# EAGLE design Ad8232_placa_V5 (EAGLE 9.6.2)
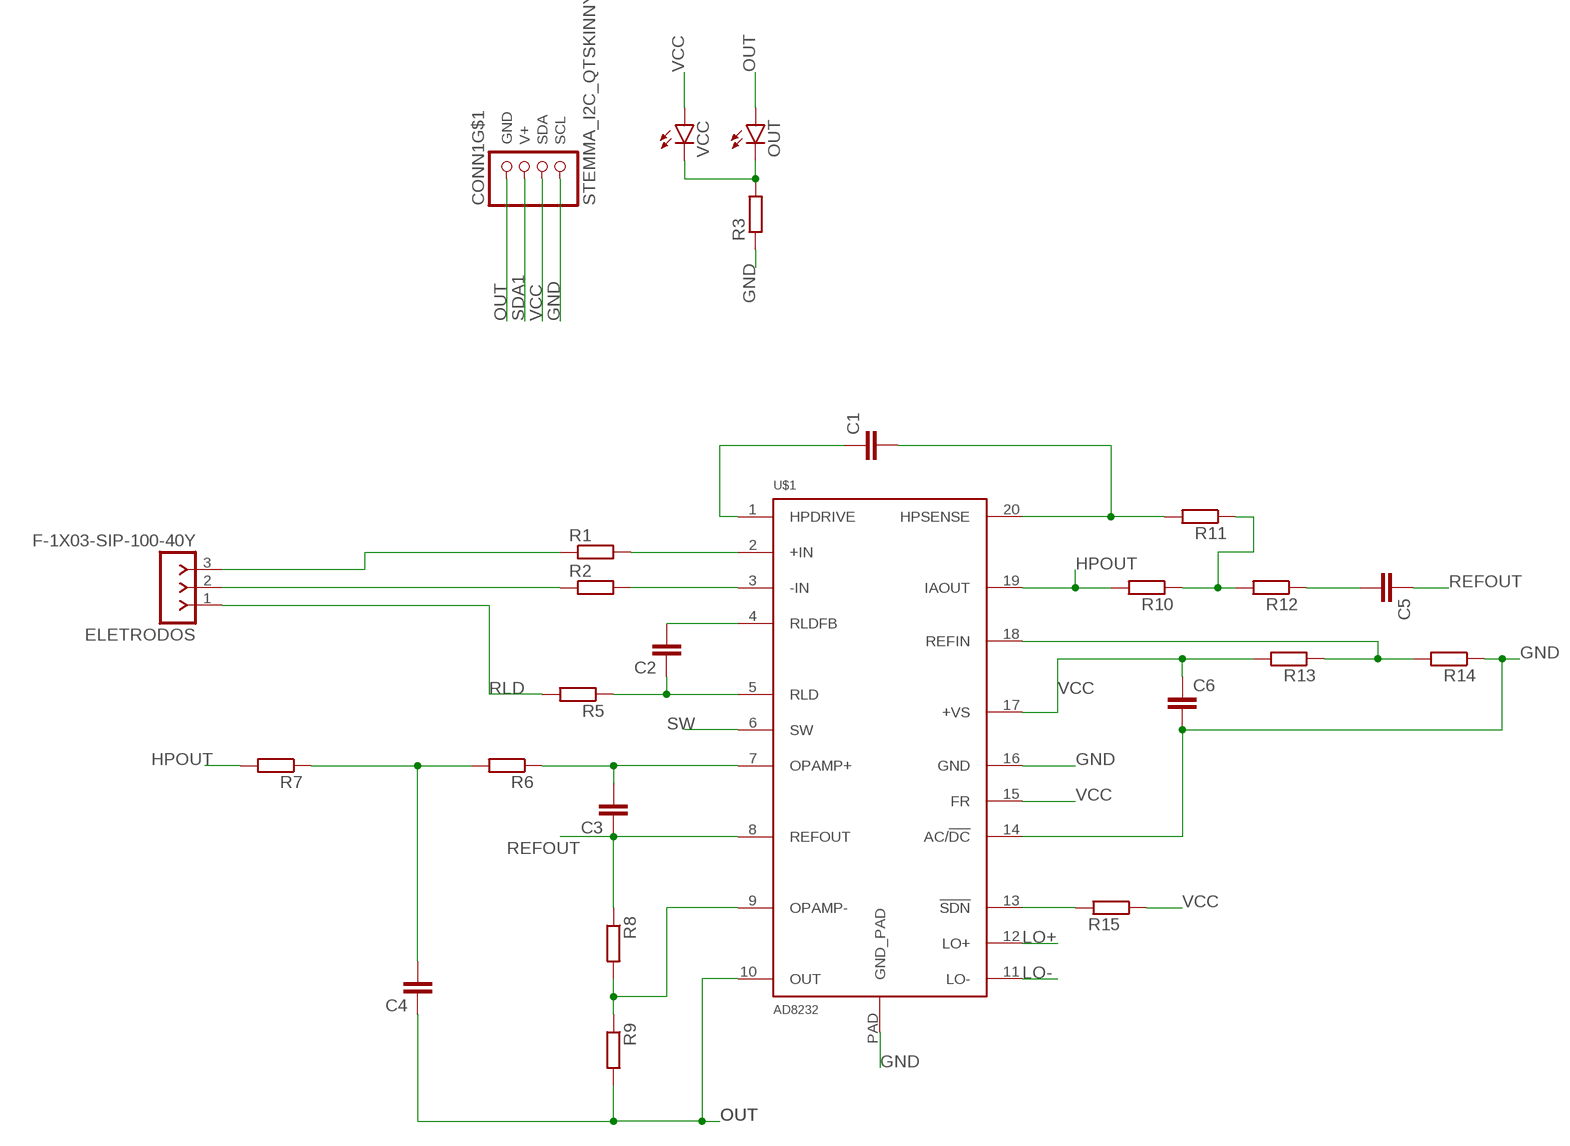
[diagram p0: schematic, sheet 1]

## Parts
C1  C-EUC0402K  [C0402K]
C2  C-EUC0402K  [C0402K]
C3  C-EUC0402K  [C0402K]
C4  C-EUC0402K  [C0402K]
C5  C-EUC0402K  [C0402K]
C6  C-EUC0402K  [C0402K]
CONN1  STEMMA_I2C_QTSKINNY  [JST_SH4_SKINNY]
ELETRODOS  F-1X03-SIP-100-40Y  [SIP-100-03-40Y]
OUT  LEDCHIPLED_0603  [CHIPLED_0603]
R1  R-EU_R0402  [R0402]
R2  R-EU_R0402  [R0402]
R3  R-EU_R0402  [R0402]
R5  R-EU_R0402  [R0402]
R6  R-EU_R0402  [R0402]
R7  R-EU_R0402  [R0402]
R8  R-EU_R0402  [R0402]
R9  R-EU_R0402  [R0402]
R10  R-EU_R0402  [R0402]
R11  R-EU_R0402  [R0402]
R12  R-EU_R0402  [R0402]
R13  R-EU_R0402  [R0402]
R14  R-EU_R0402  [R0402]
R15  R-EU_R0402  [R0402]
U$1  AD8232  [LFCSP_20]
VCC  LEDCHIPLED_0603  [CHIPLED_0603]

## Nets
GND: C6.2 CONN1.4(SCL) R3.1 R14.1 U$1.14(AC/!DC) U$1.16(GND) U$1.PAD(GND_PAD)
HPOUT: R7.2 R10.2 U$1.19(IAOUT)
LO+: U$1.12(LO+)
LO-: U$1.11(LO-)
N$1: C1.1 U$1.1(HPDRIVE)
N$2: C1.2 R11.2 U$1.20(HPSENSE)
N$3: R1.2 U$1.2(+IN)
N$4: R2.2 U$1.3(-IN)
N$5: ELETRODOS.3 R1.1
N$6: ELETRODOS.2 R2.1
N$7: C2.2 U$1.4(RLDFB)
N$8: C2.1 R5.1 U$1.5(RLD)
N$9: C3.2 R6.1 U$1.7(OPAMP+)
N$10: R13.1 R14.2 U$1.18(REFIN)
N$11: R8.2 R9.1 U$1.9(OPAMP-)
N$12: OUT.C R3.2 VCC.C
N$13: R10.1 R11.1 R12.2
N$14: C4.2 R6.2 R7.1
N$16: R15.2 U$1.13(!SDN)
OUT: C4.1 CONN1.1(GND) OUT.A R9.2 U$1.10(OUT)
REFOUT: C3.1 C5.1 R8.1 U$1.8(REFOUT)
RLD: ELETRODOS.1 R5.2
SDA1: CONN1.2(V+)
SW: C5.2 R12.1 U$1.6(SW)
VCC: C6.1 CONN1.3(SDA) R13.2 R15.1 U$1.15(FR) U$1.17(+VS) VCC.A
Unconnected: CONN1.MT1(MT) CONN1.MT2(MT)

## Library data of the parts
C1-C6 = rcl:C-EU: CAPACITOR, European symbol; SPICEPREFIX: C
CONN1 = microbuilder:STEMMA_I2C
ELETRODOS = con-headers-jp:F-1X03-: FEMALE HEADER
OUT VCC = led:LED: LED OSRAM: - CHIPLED LG R971, LG N971, LY N971, LG Q971, LY Q971, LO R971, LY R971 LH N974, LH R974 LS Q976, LO Q976, LY Q976 LO Q996 - Hyper CHIPLED LW Q18S LB Q993, LB Q99A, LB R99A - SideLED LS A670, LO A670, LY A670, LG A670, LP A670 LB A673, LV A673, LT A673, LW A673 LH A674 LY A675 LS A676, LA A676, LO A676, LY A676, LW A676 LS A679, LY A679, LG A679 - Hyper Micro SIDELED® LS Y876, LA Y876, LO Y876, LY Y876 LT Y87S - SmartLED LW L88C, LW L88S LB L89C, LB L89S, LG L890 LS L89K, LO L89K, LY L89K LS L896, LA L896, LO L896, LY L896 - TOPLED LS T670, LO T670, LY T670, LG T670, LP T670 LSG T670, LSP T670, LSY T670, LOP T670, LYG T670 LG T671, LOG T671, LSG T671 LB T673, LV T673, LT T673, LW T673 LH T674 LS T676, LA T676, LO T676, LY T676, LB T676, LH T676, LSB T676, LW T676 LB T67C, LV T67C, LT T67C, LS T67K, LO T67K, LY T67K, LW E67C LS E67B, LA E67B, LO E67B, LY E67B, LB E67C, LV E67C, LT E67C LW T67C LS T679, LY T679, LG T679 LS T770, LO T770, LY T770, LG T770, LP T770 LB T773, LV T773, LT T773, LW T773 LH T774 LS E675, LA E675, LY E675, LS T675 LS T776, LA T776, LO T776, LY T776, LB T776 LHGB T686 LT T68C, LB T68C - Hyper Mini TOPLED® LB M676 - Mini TOPLED Santana® LG M470 LS M47K, LO M47K, LY M47K Source: http://www.osram.convergy.de LUXEON: - LUMILED® LXK2-PW12-R00, LXK2-PW12-S00, LXK2-PW14-U00, LXK2-PW14-V00 LXK2-PM12-R00, LXK2-PM12-S00, LXK2-PM14-U00 LXK2-PE12-Q00, LXK2-PE12-R00, LXK2-PE12-S00, LXK2-PE14-T00, LXK2-PE14-U00 LXK2-PB12-K00, LXK2-PB12-L00, LXK2-PB12-M00, LXK2-PB14-N00, LXK2-PB14-P00, LXK2-PB14-Q00 LXK2-PR12-L00, LXK2-PR12-M00, LXK2-PR14-Q00, LXK2-PR14-R00 LXK2-PD12-Q00, LXK2-PD12-R00, LXK2-PD12-S00 LXK2-PH12-R00, LXK2-PH12-S00 LXK2-PL12-P00, LXK2-PL12-Q00, LXK2-PL12-R00 Source: www.luxeon.com KINGBRIGHT: KA-3528ASYC Source: www.kingbright.com
R1-R3 R5-R15 = rcl:R-EU_: RESISTOR, European symbol; SPICEPREFIX: R
U$1 = AD8232:AD8232: Check prices <https://pricing.snapeda.com/parts/AD8232/Analog%20Devices/view-part?ref=eda>; AVAILABILITY: Not in stock; DESCRIPTION: AD8232 Sensor Signal Conditioner Interface Evaluation Board; MF: Analog Devices; MP: AD8232; PACKAGE: LFCSP-20 Analog Devices; PRICE: None

## Net classes
1 power: width 0.254 mm

## Board
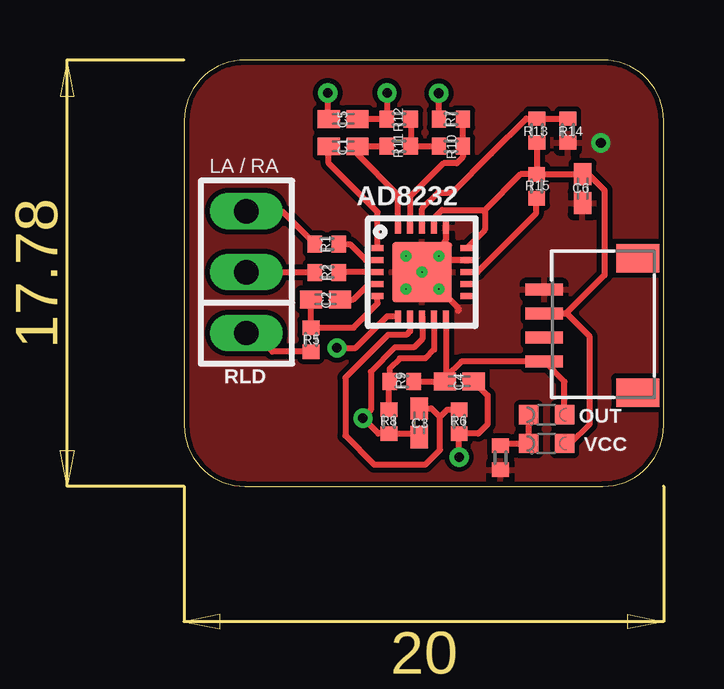
[diagram p1: board, top side]
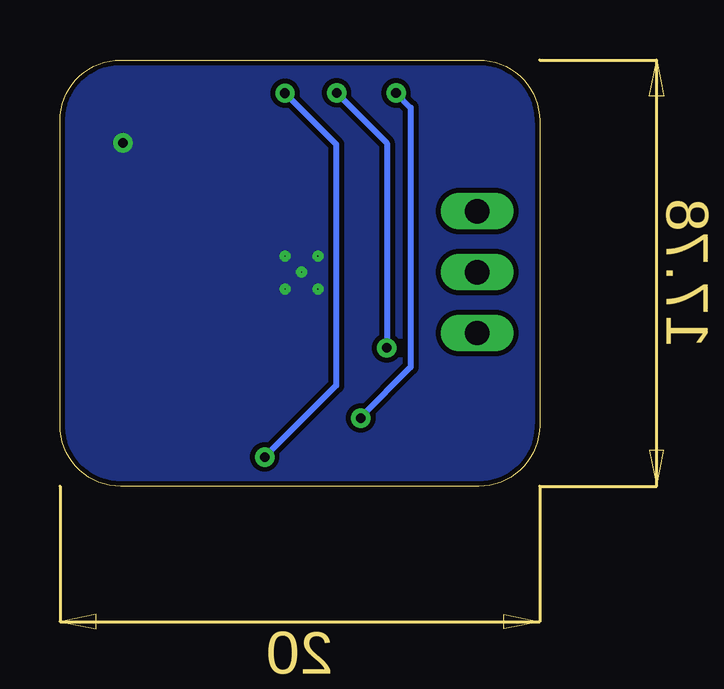
[diagram p2: board, bottom side, seen from below]

Size 20 x 17.78 mm. Coordinates in mm from the lower left corner, seen from the top.
Outline: 0,15.24 0,2.54 arc90 2.54,0 17.46,0 arc90 20,2.54 20,15.24 arc90 17.46,17.78 2.54,17.78 arc90 0,15.24
Copper layers (1*16): Top 0.035mm / dielectric 1.5mm / Bottom 0.035mm
Design rules "default *": minimum track width 10mil, minimum drill 24mil, track to track 8mil, track to pad 8mil, pad to pad 8mil, via to via 8mil, smd to smd 8mil, copper to edge 8mil, drill to drill 8mil, minimum pad ring 10mil, minimum via ring 8mil, stop-mask expansion 4mil, vias tented up to drill 0mil, thermal gap 10mil

### Footprints (pad centres in the part's own frame; a part is rotated, then mirrored left to right if it is on the bottom)
C0402K = smd 0.925 x 0.74: 1 -0.6,0; 2 0.6,0
JST_SH4_SKINNY = smd 0.5 x 1.55: 1 -1.5,2.514; 2 -0.5,2.514; 3 0.5,2.514; 4 1.5,2.514 | smd 1.2 x 1.8: MT1 -2.8,-1.386; MT2 2.8,-1.386
SIP-100-03-40Y = drill 1.016 long: 1 -2.54,0; 2 0,0; 3 2.54,0
CHIPLED_0603 = smd 0.8 x 0.8: A 0,-0.75; C 0,0.75
R0402 = smd 0.6 x 0.7: 1 -0.5,0; 2 0.5,0
LFCSP_20 = smd 0.5 x 0.25: 1 -1.85,1; 2 -1.85,0.5; 3 -1.85,0; 4 -1.85,-0.5; 5 -1.85,-1; 11 1.85,-1; 12 1.85,-0.5; 13 1.85,0; 14 1.85,0.5; 15 1.85,1 | smd 0.25 x 0.5: 6 -1,-1.85; 7 -0.5,-1.85; 8 0,-1.85; 9 0.5,-1.85; 10 1,-1.85; 16 1,1.85; 17 0.5,1.85; 18 0,1.85; 19 -0.5,1.85; 20 -1,1.85 | smd 2.5 x 2.5: PAD 0,0

### Placement (x,y rotation side)
C1  6.63,14.18 0 top
C2  5.9,7.79 0 top
C3  9.81,2.65 90 top
C4  11.47,4.38 0 top
C5  6.63,15.32 0 top
C6  16.61,12.41 270 top
CONN1  17.53,6.71 90 top
ELETRODOS  2.6,8.93 90 top
OUT  15.11,2.99 90 top
R1  5.95,10.1 0 top
R2  5.95,8.92 0 top
R3  13.19,1.19 90 top
R5  5.29,6.12 270 top
R6  11.47,2.7 270 top
R7  11.12,15.32 0 top
R8  8.54,2.7 90 top
R9  9.07,4.38 0 top
R10  11.12,14.18 0 top
R11  8.95,14.18 180 top
R12  8.95,15.32 0 top
R13  14.71,14.83 270 top
R14  16,14.83 90 top
R15  14.7,12.52 270 top
U$1  9.92,8.93 0 top
VCC  15.11,1.79 90 top

### Tracks (layer width: path | path; a pad name or v marks a point on that pad's centre or on a via)
GND  (via drill 0.05 pad 0.05, 0.4)
  Top 0.254: U$1.14 10.42,9.43 U$1.PAD | U$1.16 10.92,10.31 10.3,9.31 U$1.PAD | U$1.PAD 11.43,7.43 11.43,7.32
  other vias: 10.62,8.23 9.25,8.23 9.25,9.6 10.62,9.6 9.93,8.93 17.37,14.33
  pour Top: -0.3,18.22 20.35,18.22 20.35,-0.48 -0.3,-0.48
  pour Bottom: -1.21,18.99 -1.21,-1.02 20.83,-1.02 20.83,18.99
HPOUT
  Top 0.254: U$1.19 9.42,12.08 10.82,13.47 11.37,13.47 11.62,13.73 R10.2 R7.2
N$1
  Top 0.254: U$1.1 8.07,11.43 6.03,13.48 C1.1
N$2
  Top 0.254: R11.2 C1.2 7.23,13.85 8.92,12.15 U$1.20
N$3
  Top 0.254: U$1.2 7.57,9.43 6.91,10.1 R1.2
N$4
  Top 0.254: U$1.3 6.46,8.93 R2.2
N$5
  Top 0.254: R1.1 4.08,11.47 ELETRODOS.3 3.45,11.47
N$6
  Top 0.254: ELETRODOS.2 5.44,8.93 R2.1
N$7
  Top 0.254: U$1.4 7.7,8.43 7.06,7.79 C2.2
N$8
  Top 0.254: C2.1 R5.1 7.06,6.62 8.07,7.63 U$1.5
N$9
  Top 0.254: C3.2 10.31,3.25 10.67,2.9 | 10.67,2.9 10.67,1.52 10.06,0.91 7.92,0.91 6.72,2.12 6.72,4.54 8.51,6.32 9.27,6.32 9.42,6.47 U$1.7 | 10.67,2.9 10.98,3.2 R6.1
N$10
  Top 0.254: U$1.18 9.92,11.57 10.6,12.26 11.19,12.26 12.8,13.87 14.27,15.33 R13.1 R14.2
N$11
  Top 0.254: R8.2 8.54,4.35 R9.1 8.57,4.91 8.99,5.33 10.06,5.33 10.42,5.7 U$1.9
N$12
  Top 0.254: OUT.C VCC.C 13.28,1.79 R3.2
N$13
  Top 0.254: R12.2 R11.1 R10.1
N$14  (via drill 0.4)
  Top 0.254: R7.1 10.62,16.39 v10.62,16.4 | C4.2 12.65,3.8 12.65,2.59 12.26,2.2 R6.2 v11.46,1.22
  Bottom 0.254: v10.62,16.4 8.48,14.26 8.48,4.2 v11.46,1.22
N$16
  Top 0.254: U$1.13 12.23,8.93 14.66,11.37 14.66,11.98 R15.2
OUT
  Top 0.254: R9.2 C4.1 | C4.1 | U$1.10 10.92,4.57 | 10.92,4.57 10.92,4.43 C4.1 | 10.92,4.57 11.56,5.21 CONN1.1 15.86,4.35 OUT.A
REFOUT  (via drill 0.4, 0.41)
  Top 0.254: C5.1 5.99,15.52 v5.99,16.41 | C3.1 9.66,2.2 R8.1 8.1,2.2 v7.46,2.85 7.79,3.18 7.79,4.78 8.8,5.79 9.58,5.79 9.93,6.14 U$1.8
  Bottom 0.254: v7.46,2.85 7.46,2.9 5.38,4.98 5.38,15.8 v5.99,16.41
RLD
  Top 0.254: R5.2 3.68,5.62 2.9,6.4 ELETRODOS.1
SW  (via drill 0.4)
  Top 0.254: C5.2 R12.1 8.46,15.32 v8.46,16.41 | U$1.6 8.47,7.08 7.16,5.77 v6.37,5.77
  Bottom 0.254: v6.37,5.77 6.37,14.32 v8.46,16.41
VCC
  Top 0.254: U$1.17 10.42,11.18 10.76,11.52 12.54,11.52 | 12.54,11.52 14.03,13.02 R15.1 | R13.2 14.71,14.17 | 14.71,14.17 14.71,13.03 R15.1 | R15.1 14.85,13.17 | 14.66,14.22 14.71,14.17 | R15.1 14.76,12.95 | R15.1 C6.1 | 16.67,13.01 C6.1 | VCC.A 16.11,1.79 16.92,2.59 16.92,6.25 15.96,7.21 CONN1.3 15.93,7.21 17.53,8.8 17.53,12.34 16.86,13.01 C6.1 | 12.54,11.52 12.54,10.7 U$1.15

### Text on the board
tPlace: LA / RA
tNames: RLD